# Altium schematic sheet 工程主控原理图.SchDoc
size A3
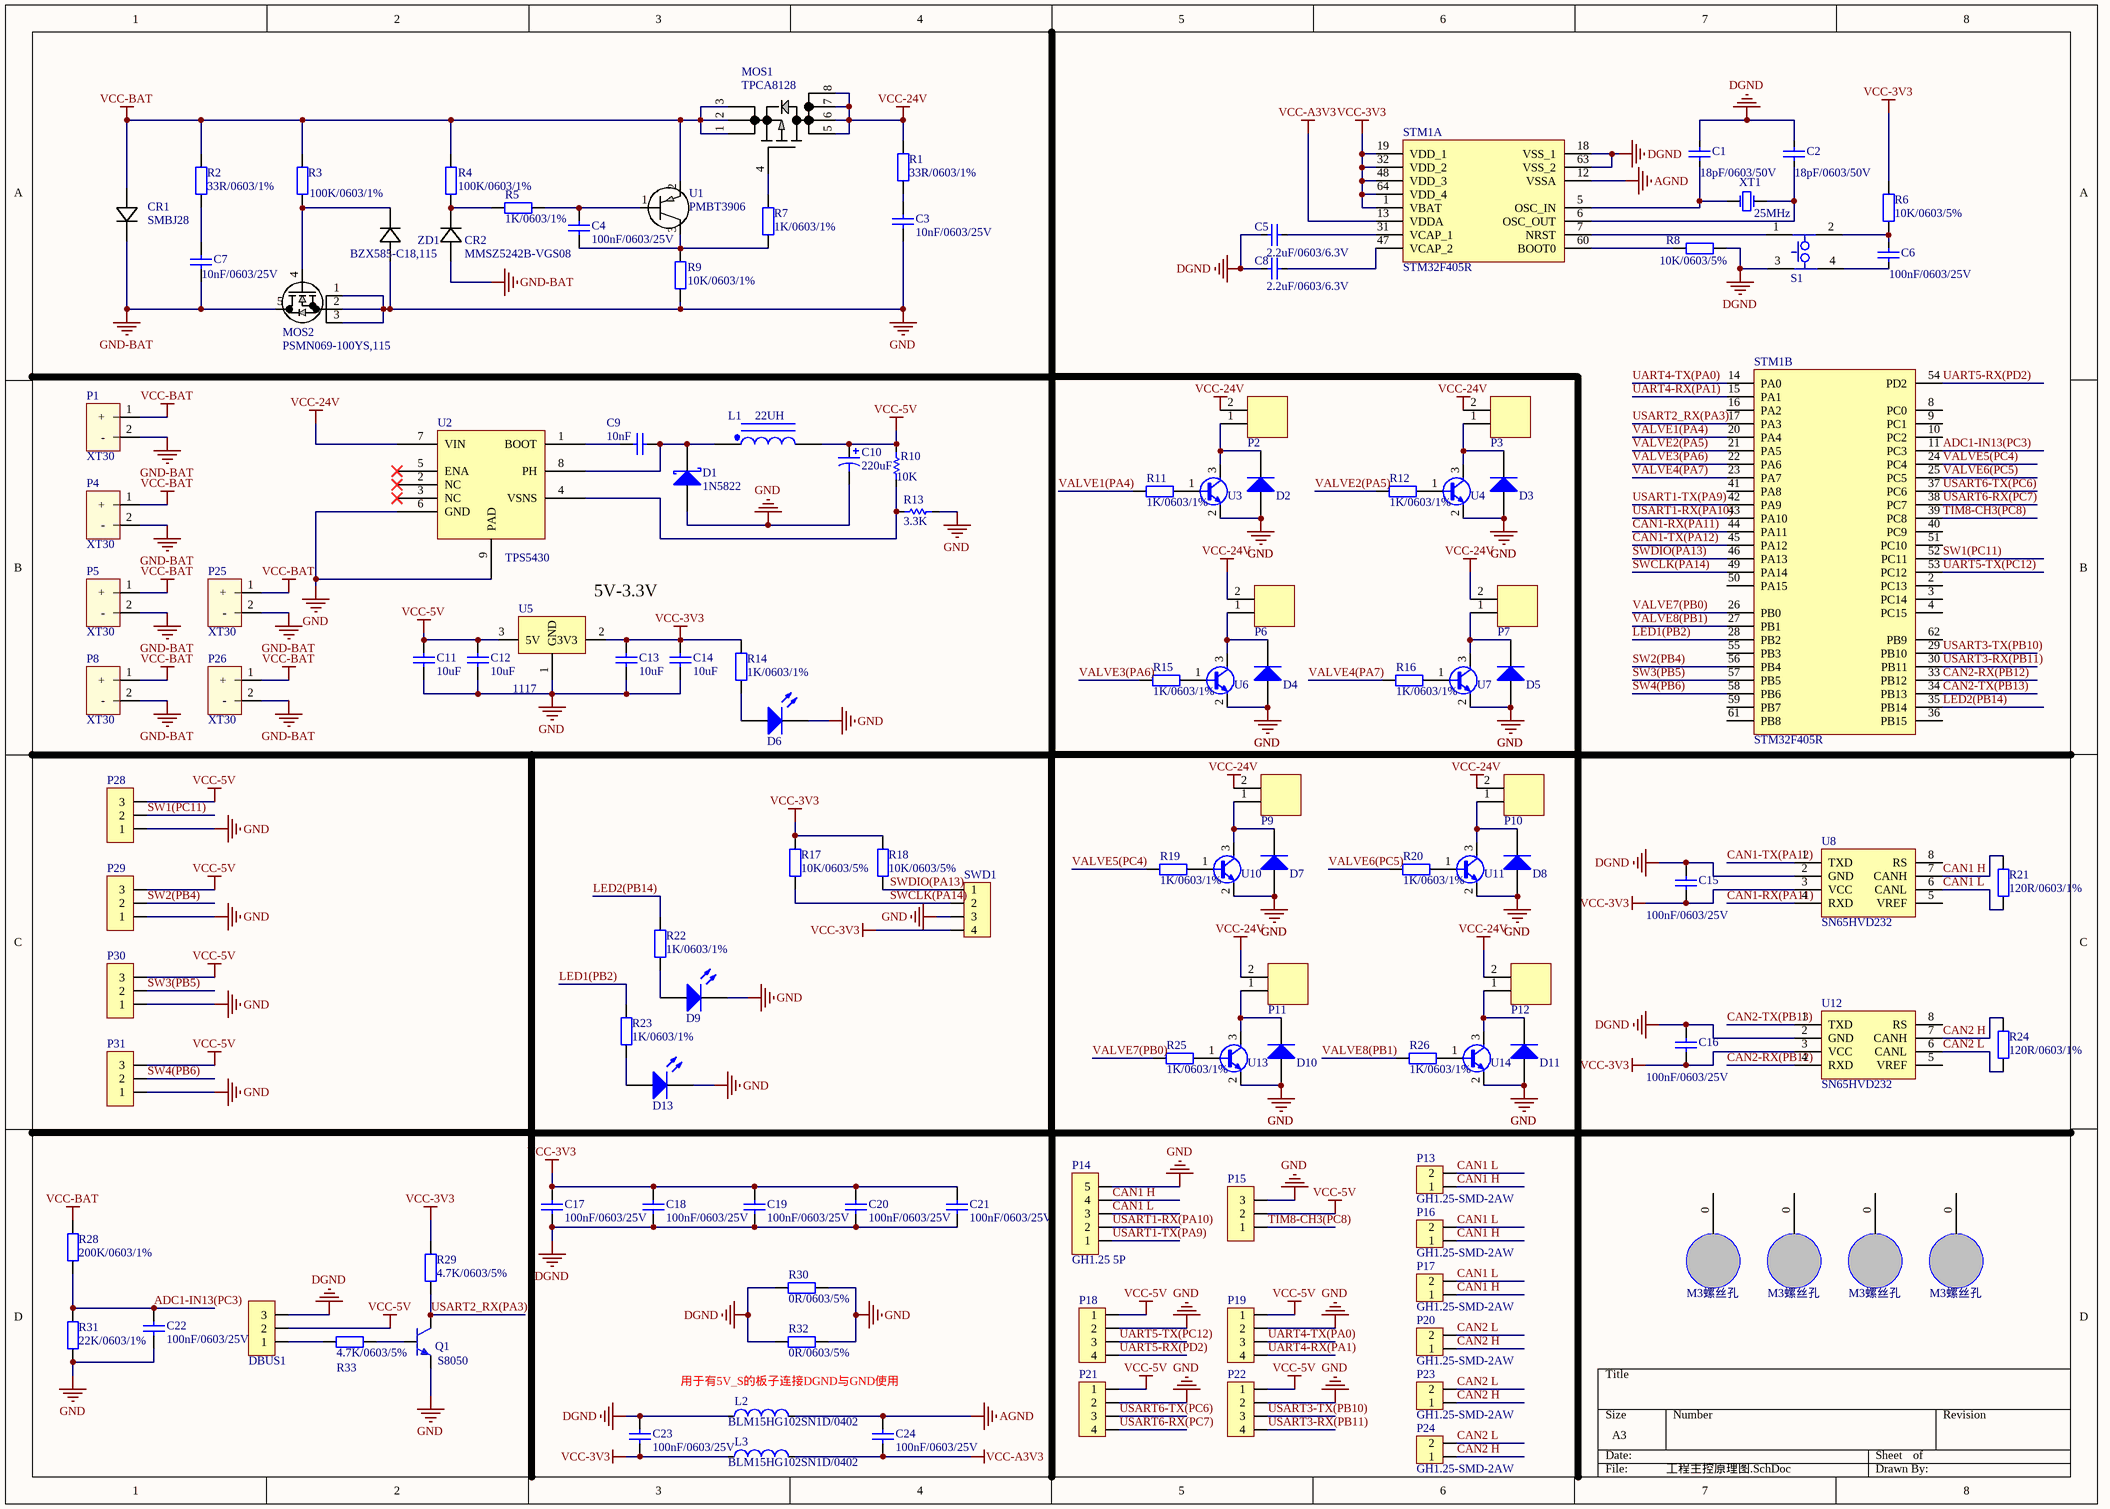
[diagram p0: 工程主控原理图.SchDoc]

## Parts
C1  value 18pF/0603/50V  [C-SMD-0603]  (hidden comment: 18pF)
C2  value 18pF/0603/50V  [C-SMD-0603]  (hidden comment: 18pF)
C3  value 10nF/0603/25V  [C-SMD-0603]  (hidden comment: 10nF)
C4  value 100nF/0603/25V  [C-SMD-0603]  (hidden comment: 100nF)
C5  value 2.2uF/0603/6.3V  [C-SMD-0603]  (hidden comment: 2.2uF)
C6  value 100nF/0603/25V  [C-SMD-0603]  (hidden comment: 100nF)
C7  value 10nF/0603/25V  [C-SMD-0603]  (hidden comment: 10nF)
C8  value 2.2uF/0603/6.3V  [C-SMD-0603]  (hidden comment: 2.2uF)
C9  10nF  [C-SMD-0603]
C10  220uF  [TCAP7343]
C11  10uF  [C-SMD-0603]
C12  10uF  [C-SMD-0603]
C13  10uF  [C-SMD-0603]
C14  10uF  [C-SMD-0603]
C15  value 100nF/0603/25V  [C-SMD-0603]  (hidden comment: 100NF)
C16  value 100nF/0603/25V  [C-SMD-0603]  (hidden comment: 100NF)
C17  value 100nF/0603/25V  [C-SMD-0603]  (hidden comment: 100nF)
C18  value 100nF/0603/25V  [C-SMD-0603]  (hidden comment: 100nF)
C19  value 100nF/0603/25V  [C-SMD-0603]  (hidden comment: 100nF)
C20  value 100nF/0603/25V  [C-SMD-0603]  (hidden comment: 100nF)
C21  value 100nF/0603/25V  [C-SMD-0603]  (hidden comment: 100nF)
C22  value 100nF/0603/25V  [C-SMD-0603]  (hidden comment: 100nF)
C23  value 100nF/0603/25V  [C-SMD-0603]  (hidden comment: 100nF)
C24  value 100nF/0603/25V  [C-SMD-0603]  (hidden comment: 100nF)
CR1  SMBJ28  [SMBJSeries_LTF]
CR2  MMSZ5242B-VGS08  [SOD123_MMS]
D1  1N5822  [SS34]
D2  Diode_SS34  [SS34]  (value not drawn)
D3  Diode_SS34  [SS34]  (value not drawn)
D4  Diode_SS34  [SS34]  (value not drawn)
D5  Diode_SS34  [SS34]  (value not drawn)
D6  LED0  [LED-0603]  (value not drawn)
D7  Diode_SS34  [SS34]  (value not drawn)
D8  Diode_SS34  [SS34]  (value not drawn)
D9  LED0  [LED-0603]  (value not drawn)
D10  Diode_SS34  [SS34]  (value not drawn)
D11  Diode_SS34  [SS34]  (value not drawn)
D13  LED0  [LED-0603]  (value not drawn)
DBUS1  Header 3  [HDR1x3]  (value not drawn)
L1  22UH  [L-7070]
L2  value BLM15HG102SN1D/0402  [l-SMD-0402]  (hidden comment: BLM15HG102SN1D)
L3  value BLM15HG102SN1D/0402  [l-SMD-0402]  (hidden comment: BLM15HG102SN1D)
M1  M3螺丝孔  [M3螺丝]
M2  M3螺丝孔  [M3螺丝]
M3  M3螺丝孔  [M3螺丝]
M4  M3螺丝孔  [M3螺丝]
MOS1  TPCA8128  [SOP Advance_TOS]
MOS2  PSMN069-100YS,115  [LFPAK56_POWER-SO8_SOT669_NEX]
P1  XT30  [XT30-F]
P2  Header  [PH2.0-2P]  (value not drawn)
P3  Header  [PH2.0-2P]  (value not drawn)
P4  XT30  [XT30-F]
P5  XT30  [XT30-F]
P6  Header  [PH2.0-2P]  (value not drawn)
P7  Header  [PH2.0-2P]  (value not drawn)
P8  XT30  [XT30-F]
P9  Header  [PH2.0-2P]  (value not drawn)
P10  Header  [PH2.0-2P]  (value not drawn)
P11  Header  [PH2.0-2P]  (value not drawn)
P12  Header  [PH2.0-2P]  (value not drawn)
P13  GH1.25-SMD-2AW  [GH1.25-SMD-2AW]
P14  GH1.25 5P  [GH1.25-SMD-5AW]
P15  Header 3  [HDR1X3]  (value not drawn)
P16  GH1.25-SMD-2AW  [GH1.25-SMD-2AW]
P17  GH1.25-SMD-2AW  [GH1.25-SMD-2AW]
P18  GH1.25-SMD-4AW  [GH1.25-SMD-4AW]  (value not drawn)
P19  GH1.25-SMD-4AW  [GH1.25-SMD-4AW]  (value not drawn)
P20  GH1.25-SMD-2AW  [GH1.25-SMD-2AW]
P21  GH1.25-SMD-4AW  [GH1.25-SMD-4AW]  (value not drawn)
P22  GH1.25-SMD-4AW  [GH1.25-SMD-4AW]  (value not drawn)
P23  GH1.25-SMD-2AW  [GH1.25-SMD-2AW]
P24  GH1.25-SMD-2AW  [GH1.25-SMD-2AW]
P25  XT30  [XT30-F]
P26  XT30  [XT30-F]
P28  Header 3  [GH1.25-SMD-3AW]  (value not drawn)
P29  Header 3  [GH1.25-SMD-3AW]  (value not drawn)
P30  Header 3  [GH1.25-SMD-3AW]  (value not drawn)
P31  Header 3  [GH1.25-SMD-3AW]  (value not drawn)
Q1  S8050  [SOT23-3]
R1  value 33R/0603/1%  [R-SMD-0603]  (hidden comment: 33R)
R2  value 33R/0603/1%  [R-SMD-0603]  (hidden comment: 33R)
R3  value 100K/0603/1%  [R-SMD-0603]  (hidden comment: 100K)
R4  value 100K/0603/1%  [R-SMD-0603]  (hidden comment: 100K)
R5  value 1K/0603/1%  [R-SMD-0603]  (hidden comment: 1K)
R6  value 10K/0603/5%  [R-SMD-0603]  (hidden comment: 10K)
R7  value 1K/0603/1%  [R-SMD-0603]  (hidden comment: 1K)
R8  value 10K/0603/5%  [R-SMD-0603]  (hidden comment: 10K)
R9  value 10K/0603/1%  [R-SMD-0603]  (hidden comment: 10K)
R10  10K  [R-SMD-0603]
R11  value 1K/0603/1%  [R-SMD-0603]  (hidden comment: 1K)
R12  value 1K/0603/1%  [R-SMD-0603]  (hidden comment: 1K)
R13  3.3K  [R-SMD-0603]
R14  value 1K/0603/1%  [R-SMD-0603]  (hidden comment: 1K)
R15  value 1K/0603/1%  [R-SMD-0603]  (hidden comment: 1K)
R16  value 1K/0603/1%  [R-SMD-0603]  (hidden comment: 1K)
R17  value 10K/0603/5%  [R-SMD-0603]  (hidden comment: 10K)
R18  value 10K/0603/5%  [R-SMD-0603]  (hidden comment: 10K)
R19  value 1K/0603/1%  [R-SMD-0603]  (hidden comment: 1K)
R20  value 1K/0603/1%  [R-SMD-0603]  (hidden comment: 1K)
R21  value 120R/0603/1%  [R-SMD-0603]  (hidden comment: 120R)
R22  value 1K/0603/1%  [R-SMD-0603]  (hidden comment: 1K)
R23  value 1K/0603/1%  [R-SMD-0603]  (hidden comment: 1K)
R24  value 120R/0603/1%  [R-SMD-0603]  (hidden comment: 120R)
R25  value 1K/0603/1%  [R-SMD-0603]  (hidden comment: 1K)
R26  value 1K/0603/1%  [R-SMD-0603]  (hidden comment: 1K)
R28  value 200K/0603/1%  [R-SMD-0603]  (hidden comment: 200K)
R29  value 4.7K/0603/5%  [R-SMD-0603]  (hidden comment: 4.7K)
R30  value 0R/0603/5%  [R-SMD-0603]  (hidden comment: 0R)
R31  value 22K/0603/1%  [R-SMD-0603]  (hidden comment: 22K)
R32  value 0R/0603/5%  [R-SMD-0603]  (hidden comment: 0R)
R33  value 4.7K/0603/5%  [R-SMD-0603]  (hidden comment: 4.7K)
S1  SKRPADE010  [SKRPADE010]  (value not drawn)
STM1  STM32F405R  [LQFP64]  (parts A,B of 2)
SWD1  GH1.25-SMD-4AW  [molex1.25-4p]  (value not drawn)
U1  PMBT3906  [SOT23_NEX]
U2  TPS5430  [TPS5430]
U3  BJT-2N5551  [SOT23-3]  (value not drawn)
U4  BJT-2N5551  [SOT23-3]  (value not drawn)
U5  1117  [AMS1117]
U6  BJT-2N5551  [SOT23-3]  (value not drawn)
U7  BJT-2N5551  [SOT23-3]  (value not drawn)
U8  SN65HVD232  [SOP-8]
U10  BJT-2N5551  [SOT23-3]  (value not drawn)
U11  BJT-2N5551  [SOT23-3]  (value not drawn)
U12  SN65HVD232  [SOP-8]
U13  BJT-2N5551  [SOT23-3]  (value not drawn)
U14  BJT-2N5551  [SOT23-3]  (value not drawn)
XT1  25MHz  [XTAL3225]
ZD1  BZX585-C18,115  [CR_85-C18,115_NEX]

## Nets
AGND: C24.2 L2.2 STM1.12(VSSA)
DGND: C1.2 C2.2 C5.2 C8.2 C15.2 C16.2 C17.1 C18.1 C19.1 C20.1 C21.1 C23.2 DBUS1.3 L2.1 R8.1 R30.1 R32.1 S1.3(B1) STM1.18(VSS_1) STM1.63(VSS_2) U8.2(GND) U12.2(GND)
GND: C3.1 C10.2 C11.1 C12.1 C13.1 C14.1 C22.1 D1.1(A) D2.1(A) D3.1(A) D4.1(A) D5.1(A) D6.2(K) D7.1(A) D8.1(A) D9.2(K) D10.1(A) D11.1(A) D13.2(K) MOS2.1(S) MOS2.2(S) MOS2.3(S) P14.5 P15.3 P18.2 P19.2 P21.2 P22.2 P28.1 P29.1 P30.1 P31.1 Q1.2(E) R9.2 R13.1(TOP) R30.2 R31.1 R32.2 SWD1.3 U2.6(GND) U2.9(PAD) U3.2(b) U4.2(b) U5.1(GND) U6.2(b) U7.2(b) U10.2(b) U11.2(b) U13.2(b) U14.2(b) ZD1.2
GND-BAT: C7.1 CR1.1 CR2.2 MOS2.5(D) P1.2(-) P4.2(-) P5.2(-) P8.2(-) P25.2(-) P26.2(-)
VCC-3V3: C13.2 C14.2 C15.1 C16.1 C17.2 C18.2 C19.2 C20.2 C21.2 C23.1 L3.1 R6.2 R14.1 R17.1 R18.1 R29.1 STM1.1(VBAT) STM1.19(VDD_1) STM1.32(VDD_2) STM1.48(VDD_3) STM1.64(VDD_4) SWD1.4 U5.2(3V3) U8.3(VCC) U12.3(VCC)
VCC-5V: C10.1 C11.2 C12.2 DBUS1.2 L1.2 P15.2 P18.1 P19.1 P21.1 P22.1 P28.3 P29.3 P30.3 P31.3 R10.1(TOP) U5.3(5V)
VCC-24V: MOS1.5 MOS1.6 MOS1.7 MOS1.8 P2.2 P3.2 P6.2 P7.2 P9.2 P10.2 P11.2 P12.2 R1.1 U2.7(VIN)
VCC-A3V3: C24.1 L3.2 STM1.13(VDDA)
VCC-BAT: CR1.2 MOS1.1 MOS1.2 MOS1.3 P1.1(+) P4.1(+) P5.1(+) P8.1(+) P25.1(+) P26.1(+) R2.1 R3.1 R4.1 R28.2 U1.2
ADC1-IN13(PC3): C22.2 R28.1 R31.2 STM1.11(PC3)
CAN1 H: P13.1 P14.4 P16.1 P17.1 R21.2 U8.7(CANH)
CAN1 L: P13.2 P14.3 P16.2 P17.2 R21.1 U8.6(CANL)
CAN1-RX(PA11): STM1.44(PA11) U8.4(RXD)
CAN1-TX(PA12): STM1.45(PA12) U8.1(TXD)
CAN2 H: P20.1 P23.1 P24.1 R24.2 U12.7(CANH)
CAN2 L: P20.2 P23.2 P24.2 R24.1 U12.6(CANL)
CAN2-RX(PB12): STM1.33(PB12) U12.4(RXD)
CAN2-TX(PB13): STM1.34(PB13) U12.1(TXD)
LED1(PB2): R23.1 STM1.28(PB2)
LED2(PB14): R22.1 STM1.35(PB14)
SW1(PC11): P28.2 STM1.52(PC11)
SW2(PB4): P29.2 STM1.56(PB4)
SW3(PB5): P30.2 STM1.57(PB5)
SW4(PB6): P31.2 STM1.58(PB6)
SWCLK(PA14): R17.2 STM1.49(PA14) SWD1.2
SWDIO(PA13): R18.2 STM1.46(PA13) SWD1.1
TIM8-CH3(PC8): P15.1 STM1.39(PC8)
UART4-RX(PA1): P19.4 STM1.15(PA1)
UART4-TX(PA0): P19.3 STM1.14(PA0)
UART5-RX(PD2): P18.4 STM1.54(PD2)
UART5-TX(PC12): P18.3 STM1.53(PC12)
USART1-RX(PA10): P14.2 STM1.43(PA10)
USART1-TX(PA9): P14.1 STM1.42(PA9)
USART2_RX(PA3): Q1.3(C) R29.2 STM1.17(PA3)
USART3-RX(PB11): P22.4 STM1.30(PB11)
USART3-TX(PB10): P22.3 STM1.29(PB10)
USART6-RX(PC7): P21.4 STM1.38(PC7)
USART6-TX(PC6): P21.3 STM1.37(PC6)
VALVE1(PA4): R11.1 STM1.20(PA4)
VALVE2(PA5): R12.1 STM1.21(PA5)
VALVE3(PA6): R15.1 STM1.22(PA6)
VALVE4(PA7): R16.1 STM1.23(PA7)
VALVE5(PC4): R19.1 STM1.24(PC4)
VALVE6(PC5): R20.1 STM1.25(PC5)
VALVE7(PB0): R25.1 STM1.26(PB0)
VALVE8(PB1): R26.1 STM1.27(PB1)
NetC1_1: C1.1 STM1.5(OSC_IN) XT1.1(OSC1)
NetC2_1: C2.1 STM1.6(OSC_OUT) XT1.3(OSC2)
NetC3_2: C3.2 R1.2
NetC4_1: C4.1 R7.1 R9.1 U1.3
NetC4_2: C4.2 R5.2 U1.1
NetC5_1: C5.1 STM1.31(VCAP_1)
NetC6_1: C6.1 S1.4(B2)
NetC6_2: C6.2 R6.1 S1.2(A2)
NetC7_2: C7.2 R2.2
NetC8_1: C8.1 STM1.47(VCAP_2)
NetC9_1: C9.1 U2.1(BOOT)
NetC9_2: C9.2 D1.2(K) L1.1 U2.8(PH)
NetCR2_1: CR2.1 R4.2 R5.1
NetD2_2: D2.2(K) P2.1 U3.3(c)
NetD3_2: D3.2(K) P3.1 U4.3(c)
NetD4_2: D4.2(K) P6.1 U6.3(c)
NetD5_2: D5.2(K) P7.1 U7.3(c)
NetD6_1: D6.1(A) R14.2
NetD7_2: D7.2(K) P9.1 U10.3(c)
NetD8_2: D8.2(K) P10.1 U11.3(c)
NetD9_1: D9.1(A) R22.2
NetD10_2: D10.2(K) P11.1 U13.3(c)
NetD11_2: D11.2(K) P12.1 U14.3(c)
NetD13_1: D13.1(A) R23.2
NetDBUS1_1: DBUS1.1 R33.2
NetMOS1_4: MOS1.4 R7.2
NetMOS2_4: MOS2.4(G) R3.2 ZD1.1
NetQ1_1: Q1.1(B) R33.1
NetR8_2: R8.2 STM1.60(BOOT0)
NetR10_2: R10.2(BOT) R13.2(BOT) U2.4(VSNS)
NetR11_2: R11.2 U3.1(e)
NetR12_2: R12.2 U4.1(e)
NetR15_2: R15.2 U6.1(e)
NetR16_2: R16.2 U7.1(e)
NetR19_2: R19.2 U10.1(e)
NetR20_2: R20.2 U11.1(e)
NetR25_2: R25.2 U13.1(e)
NetR26_2: R26.2 U14.1(e)
NetS1_1: S1.1(A1) STM1.7(NRST)

Not connected (* = marked no-connect by the designer): M1 0; M2 0; M3 0; M4 0; STM1 2(PC13) 3(PC14) 4(PC15) 8(PC0) 9(PC1) 10(PC2) 16(PA2) 36(PB15) 40(PC9) 41(PA8) 50(PA15) 51(PC10) 55(PB3) 59(PB7) 61(PB8) 62(PB9); U2 2(NC)* 3(NC)* 5(ENA)*; U8 5(VREF) 8(RS); U12 5(VREF) 8(RS)

## Notes on the sheet
- 5V-3.3V
- 用于有5V_S的板子连接DGND与GND使用

## Library data of the parts
C1 C2 C5 C6 C8 = Cap_0402: Capacitor
C3 C4 C7 C15-C24 = Cap: 贴片电容; Published: 8-Jun-2000; LatestRevisionDate: 17-Jul-2002; LatestRevisionNote: Re-released for DXP Platform.; PackageReference: RAD-0.3; Publisher: Altium Limited; PackageDescription: Radial Cap, Thru-Hole; 2 Leads; 0.3 in Pin Spacing
C9 = Cap: 无极性电容; value: 103; Published: 8-Jun-2000; LatestRevisionDate: 17-Jul-2002; LatestRevisionNote: Re-released for DXP Platform.; PackageReference: RAD-0.3; Publisher: Altium Limited
C10 = Cap Pol1: Polarized Capacitor (Radial); Published: 8-Jun-2000; LatestRevisionDate: 17-Jul-2002; LatestRevisionNote: Re-released for DXP Platform.; PackageReference: RB7.6-15; Publisher: Altium Limited; PackageDescription: Polarized Capacitor (Radial); 2 Leads; Value: 220uF
C11-C14 = Cap: 无极性电容; Published: 8-Jun-2000; LatestRevisionDate: 17-Jul-2002; LatestRevisionNote: Re-released for DXP Platform.; PackageReference: RAD-0.3; Publisher: Altium Limited; value: 10uf
CR1 = SMBJ10: No Description Available; Vendor: Littelfuse Inc; Built_By: EMA_UL_Team; SourceLibrary: LittleFuse_2015-04-13; Type: DEV; Manufacturer_Part_Number: SMBJ10; Copyright: Copyright (C) 2018 Accelerated Designs. All rights reserved; RefDes: RefDes
CR2 = MMSZ5242B-VGS08: No Description Available; Vendor: Vishay; Built_By: EMA_UL_Team; Type: DEV; Manufacturer_Part_Number: MMSZ5242B-VGS08; Copyright: Copyright (C) 2018 Accelerated Designs. All rights reserved; RefDes: RefDes
D1 = D Schottky: Schottky Diode; value: ss34; Published: 8-Jun-2000; LatestRevisionDate: 17-Jul-2002; LatestRevisionNote: Re-released for DXP Platform.; PackageReference: SMB; Publisher: Altium Limited; PackageDescription: DO-214-AA/SMB; 2 C-Bend Leads; Body 5.3 x 3.6 mm, inc. leads (LxW); Code_JEDEC: DO-214-AA
D2-D5 D7 D8 D10 D11 = Diode_SS34: 肖特基二极管
D6 D9 D13 = LED0: 发光二极管; Published: 8-Jun-2000; LatestRevisionDate: 08-Jul-2005; LatestRevisionNote: Mech Layer 1 removed.; PackageReference: LED-0; Publisher: Altium Limited
DBUS1 P15 P28-P31 = Header 3: Header; LatestRevisionDate: 17-Jul-2002; LatestRevisionNote: Re-released for DXP Platform.; Publisher: Altium Limited
L1 = Inductor Iron Dot: Magnetic-Core Inductor with Winding Polarity Marking; Published: 24-Mar-1999; LatestRevisionDate: 17-Jul-2002; LatestRevisionNote: Re-released for DXP Platform.; PackageReference: DIODE_SMC; Publisher: Altium Limited; PackageDescription: Diode; 2 Leads
L2 L3 = BLM15HG102SN1D/0402: Inductor
MOS1 = TPCA8128: No Description Available; Vendor: Toshiba; Built_By: EMA_UL_Team; SourceLibrary: Toshiba_2019-12-10; Source_Package: PMOS_TPCA8128; Number_devices_in_Package: 1; Manufacturer_Part_Number: TPCA8128; Copyright: Copyright (C) 2018 Accelerated Designs. All rights reserved; RefDes: RefDes; Type: DEV
MOS2 = PSMN069-100YS,115: No Description Available; Vendor: Nexperia; Built_By: EMA_Cory; SourceLibrary: Nexperia_2019-12-03; Manufacturer_Part_Number: PSMN069-100YS,115; Copyright: Copyright (C) 2018 Accelerated Designs. All rights reserved; RefDes: RefDes; Type: DEV
P1 P4 P5 P8 P25 P26 = XT30-F: 2P电源连接器母座
P2 P3 P6 P7 P9-P12 = Header2
P13 P16 P17 P20 P23 P24 = GH1.25-SMD-2AW: pitch 1.25mm，2P，公座（A代表公，Y代表母），卧贴
P18 P19 P21 P22 SWD1 = GH1.25-SMD-4AW: pitch 1.25mm，4P，公座（A代表公，Y代表母），卧贴
Q1 = BJT_NPN: Transistor; value: S8050
R1-R5 R7 R9 R10 R13 R14 R22 R23 R28 R31 = Res1: 贴片电阻; Published: 8-Jun-2000; LatestRevisionDate: 17-Jul-2002; LatestRevisionNote: Re-released for DXP Platform.; PackageReference: AXIAL-0.4; Publisher: Altium Limited
  R10: Value: 10K
  R13: value: 3.3K
R6 R8 R17 R18 = Res_0402: Resistor
R11 R12 R15 R16 R19-R21 R24-R26 = Res: 贴片电阻
R29 R30 R32 R33 = Res_0603: Resistor
S1 = SKRPADE010: Switch; Published: 24-Mar-1999; LatestRevisionDate: 17-Jul-2002; LatestRevisionNote: Re-released for DXP Platform.; PackageReference: DIP-4; Publisher: Altium Limited
STM1 = STM32F405R: MCU
U1 = PMBT3906: No Description Available; Vendor: Nexperia; SourceLibrary: Nexperia_2018-05-2018; Manufacturer_Part_Number: PMBT3906; Copyright: Copyright (C) 2016 Accelerated Designs. All rights reserved; RefDes: RefDes; Type: DEV
U5 = AMS1117-3.3
U8 U12 = SN65HVD232: CAN
XT1 = XTAL_5032: Crystal Oscillator; Published: 8-Jun-2000; LatestRevisionDate: 17-Jul-2002; LatestRevisionNote: Re-released for DXP Platform.; PackageReference: R38; Publisher: Altium Limited; PackageDescription: Crystal, Thru-Hole; 2 Leads; Body 3.1 x 8.2 mm (Dia.xH); Value: 25MHz
ZD1 = BZX585-C18,115: No Description Available; Built_By: EMA_Matt; Vendor: Nexperia; SourceLibrary: Add_to_database_2020-12-03; Datasheet: https://www.mouser.com/datasheet/2/916/BZX585_SERIES-1599076.pdf; Copyright: Copyright (C) 2018 Accelerated Designs. All rights reserved; Manufacturer_Part_Number: BZX585-C18,115; RefDes: RefDes; Type: DEV